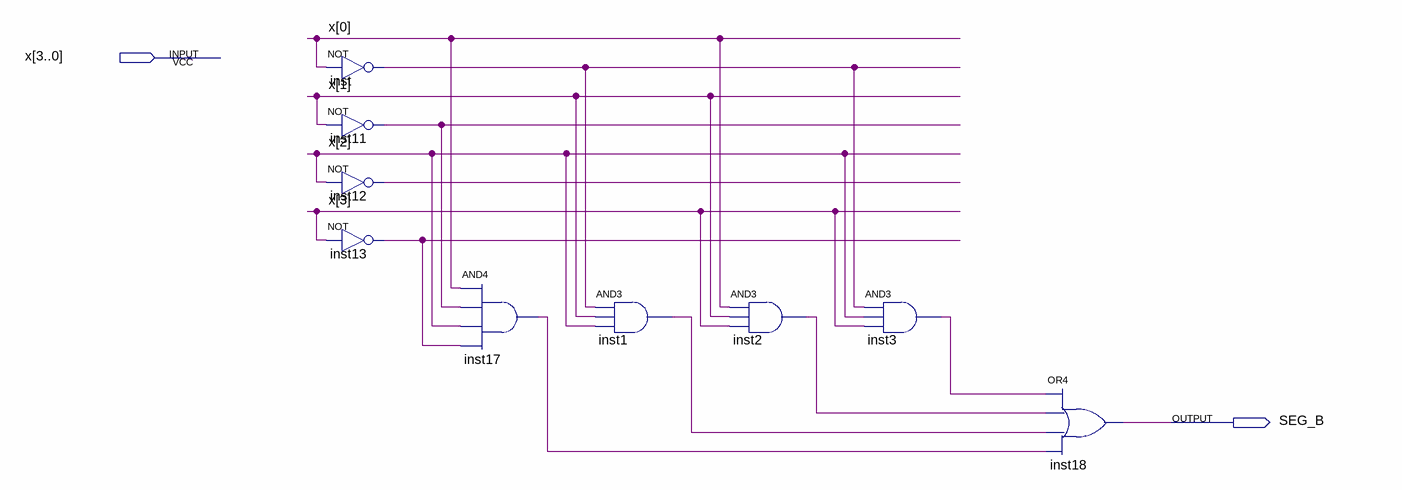
[diagram p0: schematic sheet]
// Quartus schematic SEG_B.bdf as structural Verilog: 9 symbols, 2 pins
module SEG_B (
  input  [3:0] x,
  output SEG_B
);

  wire inst1_out, inst2_out, inst3_out, inst11_out, inst12_out, inst13_out, inst17_out, inst_out;

  not inst (inst_out, x[0]);
  not inst11 (inst11_out, x[1]);
  not inst12 (inst12_out, x[2]);
  not inst13 (inst13_out, x[3]);
  and inst17 (inst17_out, x[0], inst11_out, x[2], inst13_out);
  and inst1 (inst1_out, inst_out, x[1], x[2]);
  and inst2 (inst2_out, x[0], x[1], x[3]);
  and inst3 (inst3_out, inst_out, x[2], x[3]);
  or inst18 (SEG_B, inst3_out, inst2_out, inst1_out, inst17_out);
endmodule
